# Altium schematic sheet I2C_Keypad_host_module.SchDoc
size B; Author: AM; CompanyName: Expatria Technologies; DrawnBy: A.Marles; Engineer: AM; Organization: Expatria Technologies; DocumentNumber: 13; Revision: A1; SheetNumber: 13; SheetTotal: 14; PCB_Rev: A1
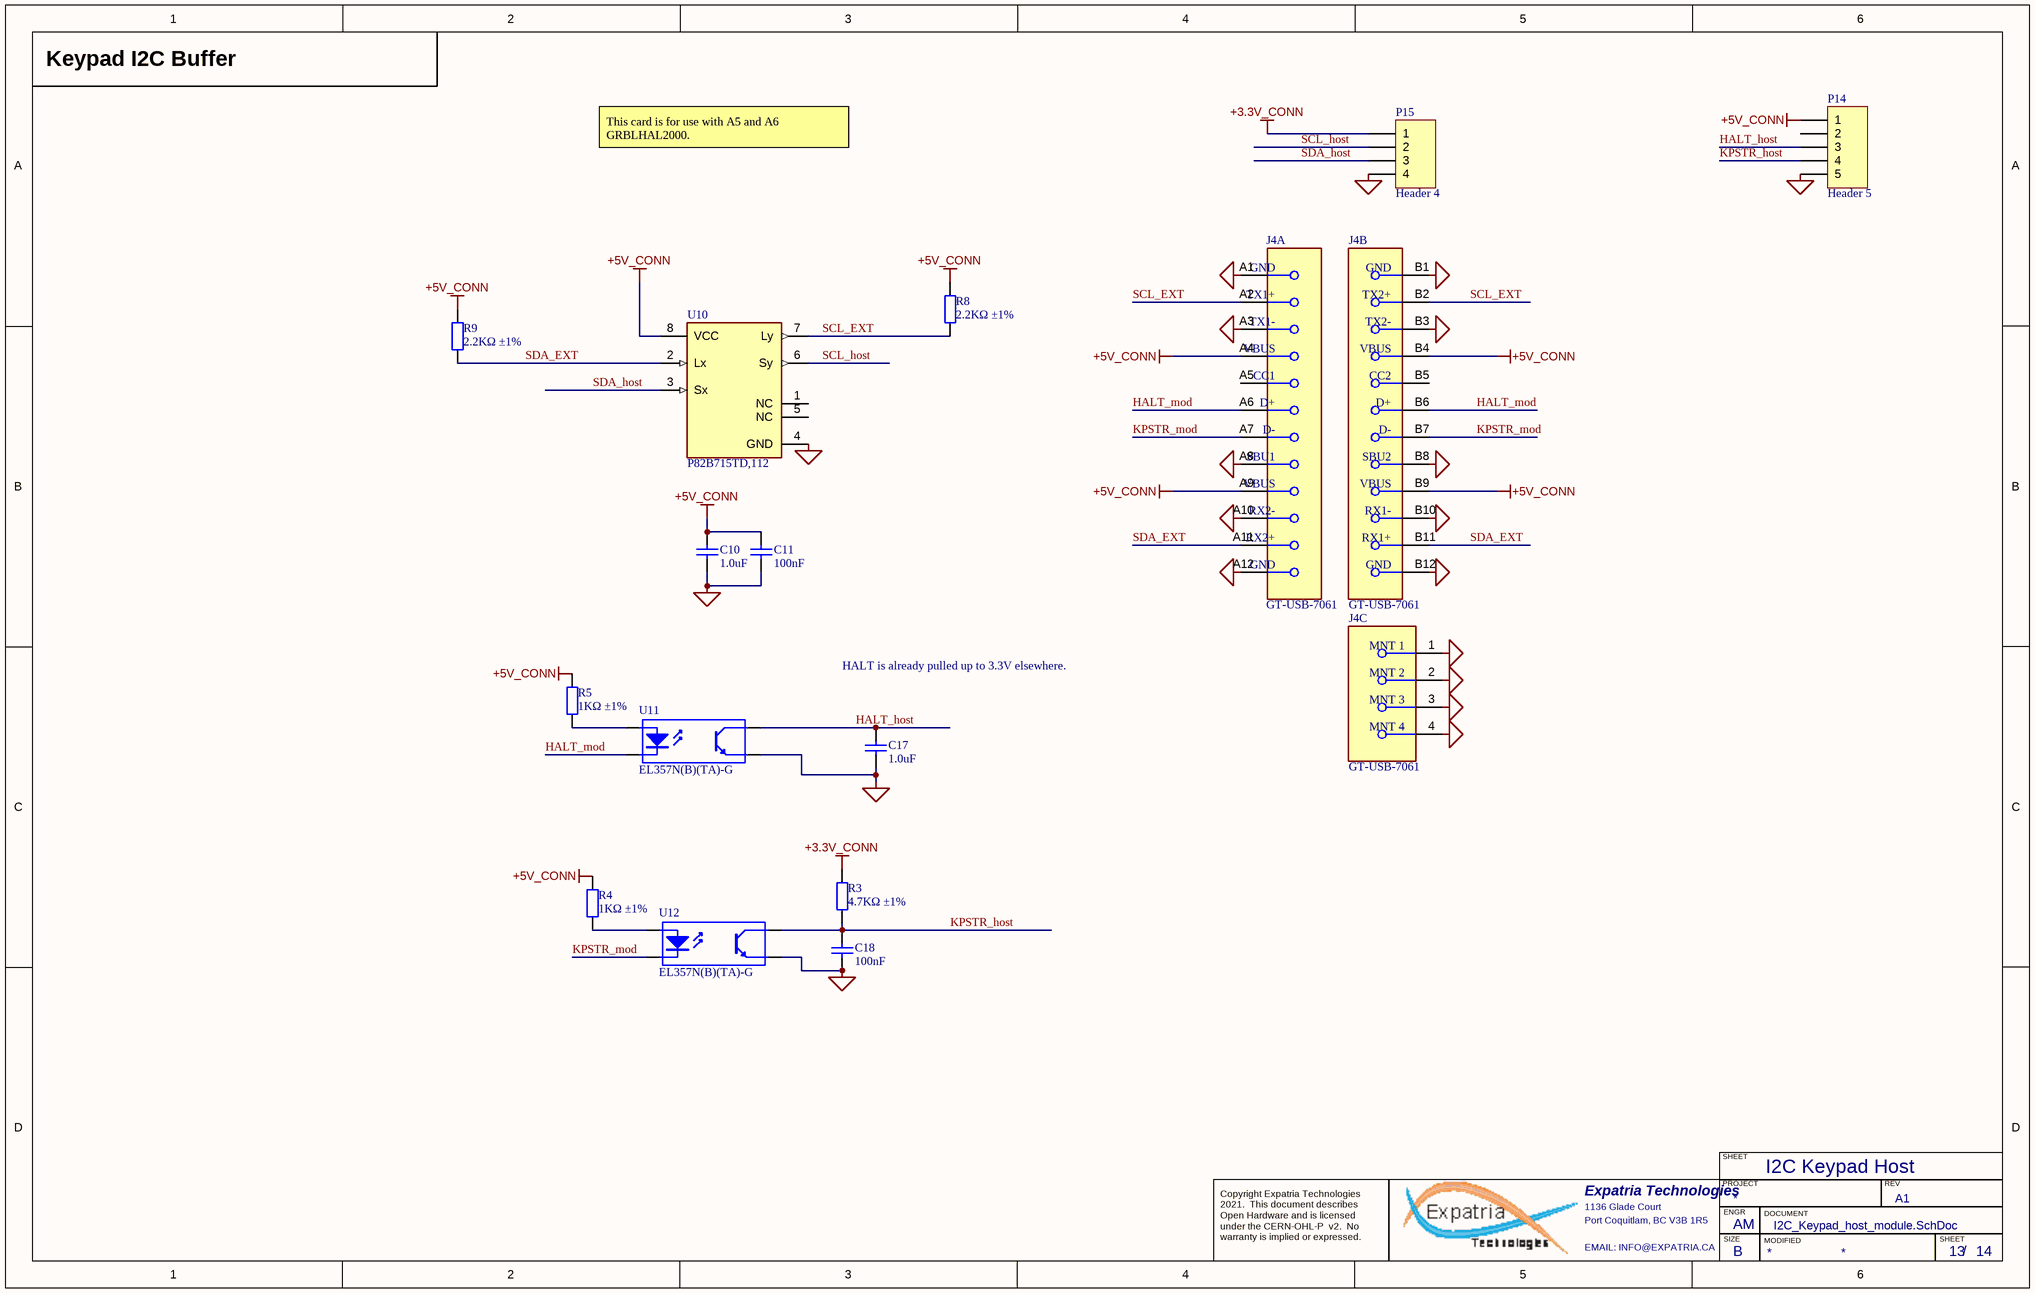
[diagram p0: I2C_Keypad_host_module.SchDoc]

## Parts
C10  1.0uF  [0402_C]
C11  100nF  [0402_C]
C17  1.0uF  [0402_C]
C18  100nF  [0402_C]
J4  GT-USB-7061  [USB-C-SMD_GT-USB-7061]  (parts A,B,C of 3)
P14  Header 5  [HDR1X5]  (no BOM)
P15  Header 4  [HDR1X4]  (no BOM)
R3  4.7KΩ ±1%  [0402_R]
R4  1KΩ ±1%  [0402_R]
R5  1KΩ ±1%  [0402_R]
R8  2.2KΩ ±1%  [0402_R]
R9  2.2KΩ ±1%  [0402_R]
U10  P82B715TD,112  [FP-SOT96-1-MFG]
U11  EL357N(B)(TA)-G  [SOP-4_P2.54]
U12  EL357N(B)(TA)-G  [SOP-4_P2.54]

## Nets
+3.3V_CONN: P15.1 R3.2
+5V_CONN: C10.2 C11.2 J4.A4(VBUS) J4.A9(VBUS) J4.B4(VBUS) J4.B9(VBUS) P14.1 R4.1 R5.1 R8.2 R9.2 U10.8(VCC)
GND_CONN: C10.1 C11.1 C17.1 C18.1 J4.1(MNT_1) J4.2(MNT_2) J4.3(MNT_3) J4.4(MNT_4) J4.A1(GND) J4.A3(TX1-) J4.A8(SBU1) J4.A10(RX2-) J4.A12(GND) J4.B1(GND) J4.B3(TX2-) J4.B8(SBU2) J4.B10(RX1-) J4.B12(GND) P14.5 P15.4 U10.4(GND) U11.3(E) U12.3(E)
HALT_host: C17.2 P14.3 U11.4(C)
HALT_mod: J4.A6(D+) J4.B6(D+) U11.2(K)
KPSTR_host: C18.2 P14.4 R3.1 U12.4(C)
KPSTR_mod: J4.A7(D-) J4.B7(D-) U12.2(K)
SCL_EXT: J4.A2(TX1+) J4.B2(TX2+) R8.1 U10.7(Ly)
SCL_host: P15.2 U10.6(Sy)
SDA_EXT: J4.A11(RX2+) J4.B11(RX1+) R9.1 U10.2(Lx)
SDA_host: P15.3 U10.3(Sx)
NetR4_2: R4.2 U12.1(A)
NetR5_2: R5.2 U11.1(A)

Not connected (* = marked no-connect by the designer): J4 A5(CC1) B5(CC2); P14 2; U10 1(NC) 5(NC)

## Notes on the sheet
- Keypad I2C Buffer
- This card is for use with A5 and A6 GRBLHAL2000.
- HALT is already pulled up to 3.3V elsewhere.
- I2C Keypad Host
- SHEET
- Expatria Technologies
- 1136 Glade Court
- Port Coquitlam, BC V3B 1R5
- PROJECT
- SIZE
- ENGR
- MODIFIED
- DOCUMENT
- REV
- Copyright Expatria Technologies 2021.  This document describes Open Hardware and is licensed under the CERN-OHL-P  v2.  No warranty is implied or expressed.
- EMAIL: INFO@EXPATRIA.CA
- B
- /

## Library data of the parts
C10 C17 = 0402 1.0uF (105) 10% 25V: Chip capacitor; Manufacturer: Samsung Electro-Mechanics; PartNumber: CL05A105KA5NQNC; Capacitance: 1uF; Tolerance: 10%; Voltage: 25V; ComponentLink1Description: Supplier link; ComponentLink1URL: http://www.szlcsc.com/product/details_53938.html; Package: 0402; Supplier: LC; SuppliersPartNumber: C52923
C11 C18 = 0402 100nF (104) 10% 16V: Chip capacitors; Manufacturer: Samsung Electro-Mechanics; PartNumber: CL05B104KO5NNNC; Tolerance: 10%; Voltage: 16V; ComponentLink1Description: Supplier link; ComponentLink1URL: http://www.szlcsc.com/product/details_1877.html; Package: 0402; Supplier: LC; SuppliersPartNumber: C1525; Capacitance: 100nF
J4 = USBC-GT-USB-7061: CONN RCP USB3.1 TYPEC 24P SMD VERT; Manufacturer: G-Switch; Manufacturer Part Number: GT-USB-7061; SuppliersPartNumber: C2762983
P14 = Header 5: Header, 5-Pin; LatestRevisionDate: 17-Jul-2002; LatestRevisionNote: Re-released for DXP Platform.; Publisher: Altium Limited; SuppliersPartNumber: C124379
P15 = Header 4: Header, 4-Pin; Publisher: Altium Limited; SuppliersPartNumber: C124378
R3 = 0402 4.7K (4701) 1%: Chip resistor; Manufacturer: Uniroyal Elec; PartNumber: 0402WGF4701TCE; Power: 1/16W; ComponentLink1Description: Supplier link; ComponentLink1URL: http://www.szlcsc.com/product/details_26643.html; Package: 0402; Supplier: LC; SuppliersPartNumber: C25900; Resistance: 4.7KΩ; Tolerance: 1%
R4 R5 = 0402 1K (1001) 1%: Chip resistor; Manufacturer: Uniroyal Elec; PartNumber: 0402WGF1001TCE; Power: 1/16W; ComponentLink1Description: Supplier link; ComponentLink1URL: http://www.szlcsc.com/product/details_12256.html; Package: 0402; Supplier: LC; SuppliersPartNumber: C11702; Resistance: 1KΩ; Tolerance: 1%
R8 R9 = 0402 2.2K (2201) 1%: Chip resistor; Manufacturer: Uniroyal Elec; PartNumber: 0402WGF2201TCE; Power: 1/16W; ComponentLink1Description: Supplier link; ComponentLink1URL: http://www.szlcsc.com/product/details_26622.html; Package: 0402; Supplier: LC; SuppliersPartNumber: C25879; Resistance: 2.2KΩ; Tolerance: 1%
U10 = CMP-10107-000005-1: IC REDRIVER I2C 1CH 400KHZ 8SO; Manufacturer: NXP Semicon; Manufacturer_Part_Number: P82B715TD,118; Package: SO-8; SuppliersPartNumber: C2652383
U11 U12 = EL357N(B)(TA)-G_[C6649]: 贴片光耦; ComponentLink1Description: 供应商链接; ComponentLink1URL: http://www.szlcsc.com/product/details_7114.html; Package: SOP-4_P2.54; Supplier: LC; SuppliersPartNumber: C6649